# Altium project elec_Teach_MC-interface.PrjPCB
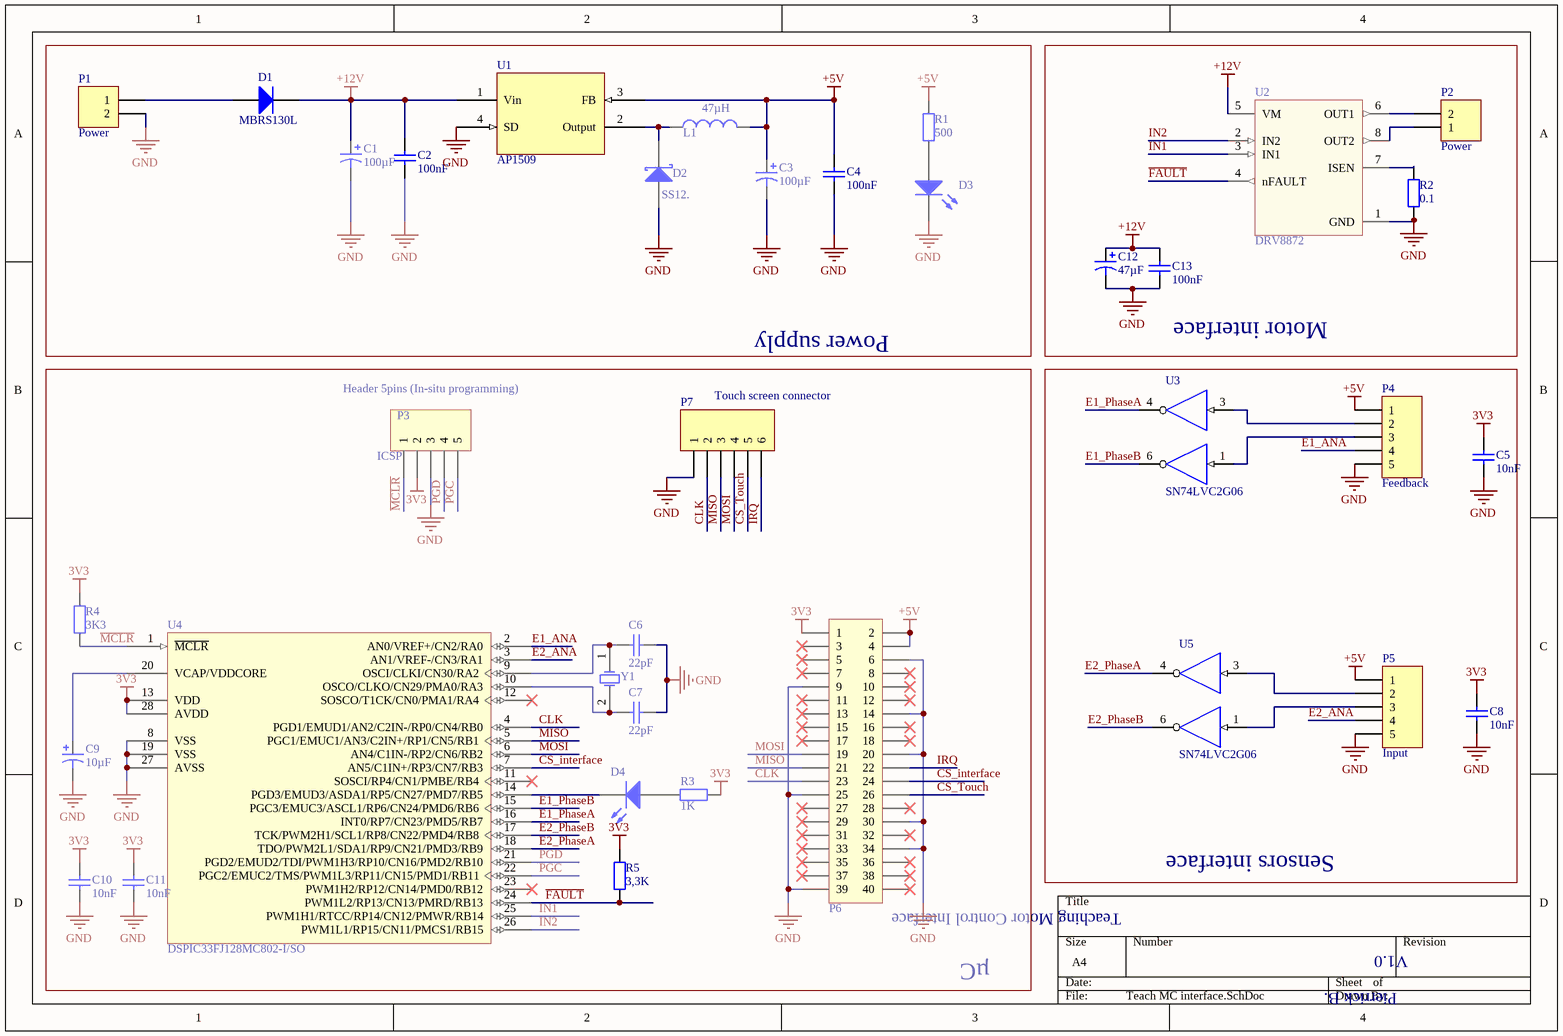
[diagram p0: Teach MC interface.SchDoc]
1 sheet, 36 parts. Net scope: global (net labels, ports and power ports of the same name join across sheets).
Board file: Teach MC interface.PcbDoc

## Sheet Teach MC interface.SchDoc
size A4

### Parts
C1  value 100µF  [Boitier tantale C]  (hidden comment: Cap Pol)
C2  value 100nF  [C0805]  (hidden comment: Cap)
C3  value 100µF  [Boitier tantale B]  (hidden comment: Cap Pol)
C4  value 100nF  [C0805]  (hidden comment: Cap)
C5  value 10nF  [C0805]  (hidden comment: Cap)
C6  value 22pF  [C0805]  (hidden comment: Cap)
C7  value 22pF  [C0805]  (hidden comment: Cap)
C8  value 10nF  [C0805]  (hidden comment: Cap)
C9  value 10µF  [Boitier tantale A]  (hidden comment: Cap Pol)
C10  value 10nF  [C0805]  (hidden comment: Cap)
C11  value 10nF  [C0805]  (hidden comment: Cap)
C12  value 47µF  [Boitier tantale B]  (hidden comment: Cap Pol)
C13  value 100nF  [C0805]  (hidden comment: Cap)
D1  MBRS130L  [SMB]
D2  SS12.  [SMA]
D3  LED1  [C0805]  (value not drawn)
D4  LED1  [C0805]  (value not drawn)
L1  value 47µH  [MCSDC0805]  (hidden comment: Inductor)
P1  Power  [20.501M/2]
P2  Power  [20.501M/2]
P3  ICSP  [HDR1X5]
P4  Feedback  [HDR1X5]
P5  Input  [HDR1X5]
P6  Header 40  [Raspberry Pi b+]  (value not drawn)
P7  Touch screen connector  [HDR1X6]
R1  value 500  [0603]  (hidden comment: Res2)
R2  value 0.1  [2512]  (hidden comment: Res2)
R3  value 1K  [0805]  (hidden comment: Res2)
R4  value 3K3  [0805]  (hidden comment: Res2)
R5  value 3,3K  [0603]  (hidden comment: Res2)
U1  AP1509  [SOP-8L]
U2  DRV8872  [DDA]
U3  SN74LVC2G06  [DBV-6]
U4  DSPIC33FJ128MC802-I/SO  [SOIC-SO28_N]
U5  SN74LVC2G06  [DBV-6]
Y1  10MHz  [DX-57]  (value not drawn)

### Blocks framed on the sheet
Power supply: C1-C4 D1-D3 L1 P1 R1 U1
Motor interface: C12 C13 P2 R2 U2
µC: C6 C7 C9-C11 D4 P3 P6 P7 R3-R5 U4 Y1
Sensors interface: C5 C8 P4 P5 U3 U5

### Nets
3V3: C5.2 C8.2 C10.2 C11.2 P3.2 P6.1 R3.1 R4.2 R5.2 U3.5(Vcc) U4.13(VDD) U4.28(AVDD) U5.5(Vcc)
+5V: C3.1 C4.2 L1.2 P4.1 P5.1 P6.2 P6.4 R1.2 U1.3(FB)
+12V: C1.1 C2.2 C12.1 C13.2 D1.2(K) U1.1(Vin) U2.5(VM)
GND: C1.2 C2.1 C3.2 C4.1 C5.1 C6.1 C7.1 C8.1 C9.2 C10.1 C11.1 C12.2 C13.1 D2.1(A) D3.2(K) P1.2 P3.3 P4.5 P5.5 P6.6 P6.9 P6.14 P6.20 P6.25 P6.30 P6.34 P6.39 P7.1 R2.1 U1.4(SD) U1.5(GND) U1.6(GND) U1.7(GND) U1.8(GND) U2.1(GND) U2.PPAD U3.2(GND) U4.8(VSS) U4.19(VSS) U4.27(AVSS) U5.2(GND)
CLK: P6.23 P7.2 U4.4(PGD1/EMUD1/AN2/C2IN-/RP0/CN4/RB0)
CS_interface: P6.24 U4.7(AN5/C1IN+/RP3/CN7/RB3)
CS_Touch: P6.26 P7.5
E1_ANA: P4.4 U4.2(AN0/VREF+/CN2/RA0)
E1_PhaseA: U3.4(2Y) U4.16(INT0/RP7/CN23/PMD5/RB7)
E1_PhaseB: U3.6(1Y) U4.15(PGC3/EMUC3/ASCL1/RP6/CN24/PMD6/RB6)
E2_ANA: P5.4 U4.3(AN1/VREF-/CN3/RA1)
E2_PhaseA: U4.18(TDO/PWM2L1/SDA1/RP9/CN21/PMD3/RB9) U5.4(2Y)
E2_PhaseB: U4.17(TCK/PWM2H1/SCL1/RP8/CN22/PMD4/RB8) U5.6(1Y)
~{FAULT}: R5.1 U2.4(nFAULT) U4.24(PWM1L2/RP13/CN13/PMRD/RB13)
IN1: U2.3(IN1) U4.25(PWM1H1/RTCC/RP14/CN12/PMWR/RB14)
IN2: U2.2(IN2) U4.26(PWM1L1/RP15/CN11/PMCS1/RB15)
IRQ: P6.22 P7.6
~{MCLR}: P3.1 R4.1 U4.1(~{MCLR})
MISO: P6.21 P7.3 U4.5(PGC1/EMUC1/AN3/C2IN+/RP1/CN5/RB1)
MOSI: P6.19 P7.4 U4.6(AN4/C1IN-/RP2/CN6/RB2)
PGC: P3.5 U4.22(PGC2/EMUC2/TMS/PWM1L3/RP11/CN15/PMD1/RB11)
PGD: P3.4 U4.21(PGD2/EMUD2/TDI/PWM1H3/RP10/CN16/PMD2/RB10)
NetC6_2: C6.2 U4.9(OSCI/CLKI/CN30/RA2) Y1.1(OSC1)
NetC7_2: C7.2 U4.10(OSCO/CLKO/CN29/PMA0/RA3) Y1.2(OSC2)
NetC9_1: C9.1 U4.20(VCAP/VDDCORE)
NetD1_1: D1.1(A) P1.1
NetD2_2: D2.2(K) L1.1 U1.2(Output)
NetD3_1: D3.1(A) R1.1
NetD4_1: D4.1(A) R3.2
NetD4_2: D4.2(K) U4.14(PGD3/EMUD3/ASDA1/RP5/CN27/PMD7/RB5)
NetP2_1: P2.1 U2.8(OUT2)
NetP2_2: P2.2 U2.6(OUT1)
NetP4_2: P4.2 U3.3(2A)
NetP4_3: P4.3 U3.1(1A)
NetP5_2: P5.2 U5.3(2A)
NetP5_3: P5.3 U5.1(1A)
NetR2_2: R2.2 U2.7(ISEN)

Not connected (* = marked no-connect by the designer): P6 3* 5* 7* 8* 10* 11* 12* 13* 15* 16* 17* 18* 27* 28* 29* 31* 32* 33* 35* 36* 37* 38* 40*; U4 11(SOSCI/RP4/CN1/PMBE/RB4)* 12(SOSCO/T1CK/CN0/PMA1/RA4)* 23(PWM1H2/RP12/CN14/PMD0/RB12)*

### Notes on the sheet
- Header 5pins (In-situ programming)
- Teaching Motor Control Interface
- Pierrick B.
- V1.0

### Library data of the parts
C1 C3 C9 C12 = Cap Pol: Polarized Capacitor; Published: 8-Jun-2000; LatestRevisionDate: 17-Jul-2002; LatestRevisionNote: Re-released for DXP Platform.; PackageReference: POLAR0.8; Publisher: Altium Limited
C2 C4-C8 C10 C11 C13 = Cap: Capacitor; Published: 8-Jun-2000; LatestRevisionDate: 17-Jul-2002; LatestRevisionNote: Re-released for DXP Platform.; PackageReference: RAD-0.3; Publisher: Altium Limited
  C2 C4 C6 C7 C13: Supplier: FARNELL
D1 = Diode: Default Diode; Published: 8-Jun-2000; LatestRevisionDate: 17-Jul-2002; LatestRevisionNote: Re-released for DXP Platform.; PackageDocument: Sep-1996; PackageReference: SMC; Publisher: Altium Limited; Code_JEDEC: DO-214-AB
D2 = Diode Schottky: Published: 8-Jun-2000; LatestRevisionDate: 17-Jul-2002; LatestRevisionNote: Re-released for DXP Platform.; PackageReference: SMB; Publisher: Altium Limited; Code_JEDEC: DO-214-AA
D3 D4 = LED1: Typical RED GaAs LED; Published: 8-Jun-2000; LatestRevisionDate: 08-Jul-2005; LatestRevisionNote: Mech Layer 1 removed.; PackageReference: LED-1; Publisher: Altium Limited
L1 = Inductor: Code_IEC: 1005; Published: 8-Jun-2000; LatestRevisionDate: 17-Jul-2002; LatestRevisionNote: Re-released for DXP Platform.; PackageReference: 0402-A; Publisher: Altium Limited; Code_JEITA: 0402
P1 P2 = Header 2: Header, 2-Pin; LatestRevisionDate: 17-Jul-2002; LatestRevisionNote: Re-released for DXP Platform.; Publisher: Altium Limited
P3-P5 = Header 5: Header, 5-Pin; LatestRevisionDate: 17-Jul-2002; LatestRevisionNote: Re-released for DXP Platform.; Publisher: Altium Limited
P7 = Header 6: Header, 6-Pin; Supplie: FARNELL
R1-R5 = Res2: Resistor; Published: 8-Jun-2000; LatestRevisionDate: 17-Jul-2002; LatestRevisionNote: Re-released for DXP Platform.; PackageReference: AXIAL-0.4; Publisher: Altium Limited
  R3 R5: Supplier: FARNELL
U1 = AP1509: 24V Input, 1A/2A Output, High Efficiency 150KHz, 2A PWM BUCK DC/DC CONVERTER
U2 = DRV8872: 3.6A Brushed  DC Motor  Driver  With Fault Reporting
U4 = DSPIC33FJ128MC802-I/SO: High-Performance 16-bit Digital Signal Controller, 128 KB Flash, 16 KB RAM, 28-Pin SOIC, Industrial Temperature; Published: 29-Jan-2009; DatasheetVersion: revB, Mar-2008; PackageVersion: revAW, Oct-2008; PackageReference: SOIC-SO28; Publisher: Altium Limited; PackageDescription: 28-Lead Plastic Small Outline (SO) - Wide 7.50mm Body [SOIC]; Code_JEDEC: MS-013; ComponentLink1Description: Manufacturer Link; ComponentLink1URL: http://www.microchip.com; ComponentLink2Description: Datasheet; ComponentLink2URL: http://ww1.microchip.com/downloads/en/DeviceDoc/70291B.pdf; ComponentLink3Description: Packaging Specification; ComponentLink3URL: http://ww1.microchip.com/downloads/en/PackagingSpec/00049AW.pdf
Y1 = XTAL: Crystal Oscillator; Published: 8-Jun-2000; LatestRevisionDate: 17-Jul-2002; LatestRevisionNote: Re-released for DXP Platform.; PackageReference: R38; Publisher: Altium Limited; Supplier: FARNELL